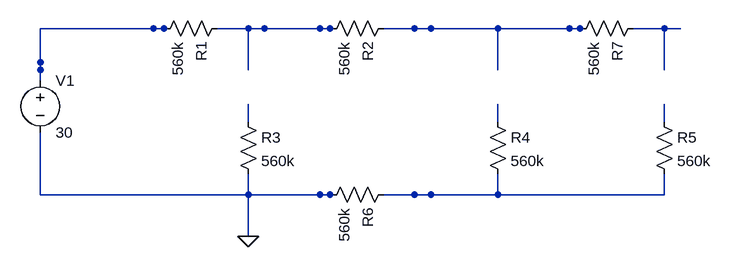
[diagram p0: schematic pannel_3.asc]
pannel_3.asc, the LTspice schematic file:
Version 4
SHEET 1 880 680
WIRE 464 256 537 256
WIRE 366 256 382 256
SYMBOL res 480 240 R90
SYMATTR InstName R1
SYMATTR Value 560k
WIRE 720 256 793 256
WIRE 622 256 638 256
SYMBOL res 736 240 R90
SYMATTR InstName R2
SYMATTR Value 560k
WIRE 512 400 512 372
WIRE 512 512 512 480
SYMBOL res 496 384 R0
SYMATTR InstName R3
SYMATTR Value 560k
WIRE 896 400 896 372
WIRE 896 512 896 480
SYMBOL res 880 384 R0
SYMATTR InstName R4
SYMATTR Value 560k
WIRE 1152 400 1152 372
WIRE 1152 512 1152 480
SYMBOL res 1136 384 R0
SYMATTR InstName R5
SYMATTR Value 560k
WIRE 720 512 793 512
WIRE 622 512 638 512
SYMBOL res 736 496 R90
SYMATTR InstName R6
SYMATTR Value 560k
WIRE 1104 256 1177 256
WIRE 1006 256 1022 256
SYMBOL res 1120 240 R90
SYMATTR InstName R7
SYMATTR Value 560k
FLAG 512 576 0
WIRE 192 336 192 308
WIRE 192 448 192 416
SYMBOL voltage 192 320 R0
SYMATTR InstName V1
SYMATTR Value 30
WIRE 512 512 576 512
WIRE 512 512 512 576
WIRE 448 512 512 512
WIRE 896 512 960 512
WIRE 832 512 896 512
WIRE 1088 512 1152 512
WIRE 1152 256 1152 320
WIRE 192 256 256 256
WIRE 192 256 192 320
WIRE 192 512 256 512
WIRE 192 448 192 512
WIRE 512 256 576 256
WIRE 512 256 512 320
WIRE 896 256 960 256
WIRE 832 256 896 256
WIRE 896 256 896 320
WIRE 256 512 320 512
WIRE 320 512 384 512
WIRE 384 512 448 512
WIRE 576 512 640 512
WIRE 768 512 832 512
WIRE 960 512 1024 512
WIRE 1024 512 1088 512
WIRE 960 256 1024 256
WIRE 768 256 832 256
WIRE 576 256 640 256
WIRE 320 256 384 256
WIRE 256 256 320 256

The netlist it stands for:
* pannel_3.asc
R1 N001 N002 560k
R2 N003 N001 560k
R3 N004 0 560k
R4 N005 N006 560k
R5 N007 N006 560k
R6 N006 0 560k
R7 N008 N003 560k
V1 N002 0 30
.backanno
.end